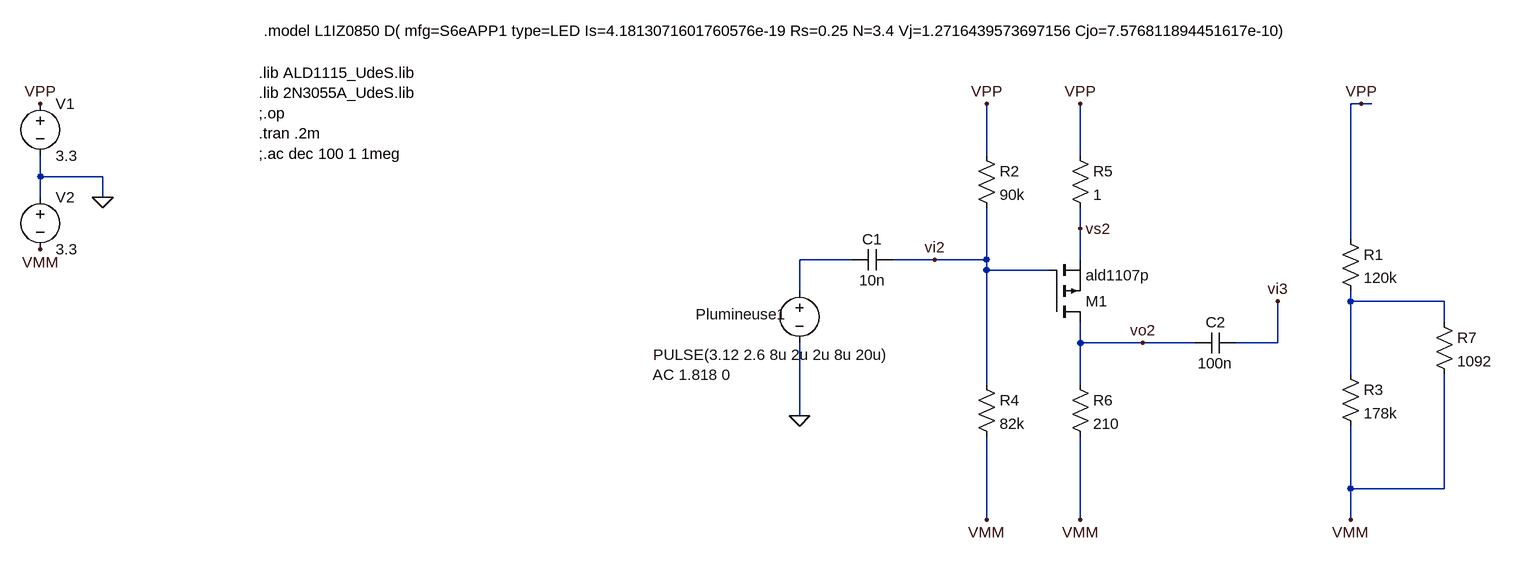
[diagram p0: schematic etage2.asc]
etage2.asc, the LTspice schematic file:
Version 4
SHEET 1 2260 1556
WIRE 1056 -48 1040 -48
WIRE 1072 -48 1056 -48
WIRE 480 32 480 -48
WIRE 624 32 624 -48
WIRE -976 64 -976 32
WIRE -880 64 -976 64
WIRE -976 96 -976 64
WIRE -880 96 -880 64
WIRE 624 144 624 112
WIRE 1040 160 1040 -48
WIRE 272 192 192 192
WIRE 400 192 336 192
WIRE 480 192 480 112
WIRE 480 192 400 192
WIRE 624 192 624 144
WIRE 480 208 480 192
WIRE 576 208 480 208
WIRE 192 240 192 192
WIRE 1040 256 1040 240
WIRE 1184 256 1040 256
WIRE 1184 288 1184 256
WIRE 624 320 624 288
WIRE 720 320 624 320
WIRE 800 320 720 320
WIRE 928 320 928 256
WIRE 928 320 864 320
WIRE 1040 368 1040 256
WIRE 480 384 480 208
WIRE 624 384 624 320
WIRE 192 432 192 320
WIRE 1040 544 1040 448
WIRE 1184 544 1184 368
WIRE 1184 544 1040 544
WIRE 480 592 480 464
WIRE 624 592 624 464
WIRE 1040 592 1040 544
FLAG -976 -48 VPP
FLAG -976 176 VMM
FLAG -880 96 0
FLAG 480 -48 VPP
FLAG 480 592 VMM
FLAG 624 -48 VPP
FLAG 624 592 VMM
FLAG 400 192 vi2
FLAG 720 320 vo2
FLAG 624 144 vs2
FLAG 928 256 vi3
FLAG 192 432 0
FLAG 1056 -48 VPP
FLAG 1040 592 VMM
SYMBOL /voltage -976 -64 R0
WINDOW 123 0 0 Left 0
WINDOW 39 0 0 Left 0
SYMATTR InstName V1
SYMATTR Value 3.3
SYMBOL /voltage -976 80 R0
WINDOW 123 0 0 Left 0
WINDOW 39 0 0 Left 0
SYMATTR InstName V2
SYMATTR Value 3.3
SYMBOL /pmos 576 288 M180
SYMATTR InstName M1
SYMATTR Value ald1107p
SYMATTR Prefix X
SYMBOL /res 464 16 R0
SYMATTR InstName R2
SYMATTR Value 90k
SYMBOL /res 464 368 R0
SYMATTR InstName R4
SYMATTR Value 82k
SYMBOL /res 608 16 R0
SYMATTR InstName R5
SYMATTR Value 1
SYMBOL /res 608 368 R0
SYMATTR InstName R6
SYMATTR Value 210
SYMBOL voltage 192 224 R0
WINDOW 3 -225 114 Left 2
WINDOW 123 -226 145 Left 2
WINDOW 39 0 0 Left 0
WINDOW 0 -160 52 Left 2
SYMATTR Value PULSE(3.12 2.6 8u 2u 2u 8u 20u)
SYMATTR Value2 AC 1.818 0
SYMATTR InstName Plumineuse1
SYMBOL cap 336 176 R90
WINDOW 0 0 32 VBottom 2
WINDOW 3 32 32 VTop 2
SYMATTR InstName C1
SYMATTR Value 10n
SYMBOL res 1024 144 R0
SYMATTR InstName R1
SYMATTR Value 120k
SYMBOL res 1024 352 R0
SYMATTR InstName R3
SYMATTR Value 178k
SYMBOL cap 864 304 R90
WINDOW 0 0 32 VBottom 2
WINDOW 3 32 32 VTop 2
SYMATTR InstName C2
SYMATTR Value 100n
SYMBOL res 1168 272 R0
SYMATTR InstName R7
SYMATTR Value 1092
TEXT -640 -96 Left 2 !.lib ALD1115_UdeS.lib\n.lib 2N3055A_UdeS.lib\n;.op\n.tran .2m\n;.ac dec 100 1 1meg
TEXT -632 -160 Left 2 !.model L1IZ0850 D( mfg=S6eAPP1 type=LED Is=4.1813071601760576e-19 Rs=0.25 N=3.4 Vj=1.2716439573697156 Cjo=7.576811894451617e-10)

The netlist it stands for:
* etage2.asc
V1 VPP 0 3.3
V2 0 VMM 3.3
XM1 vo2 vi2 vs2 ald1107p  ; pins D G S
R2 VPP vi2 90k
R4 vi2 VMM 82k
R5 VPP vs2 1
R6 vo2 VMM 210
V§Plumineuse1 N001 0 PULSE(3.12 2.6 8u 2u 2u 8u 20u) AC 1.818 0
C1 vi2 N001 10n
R1 VPP N002 120k
R3 N002 VMM 178k
C2 vi3 vo2 100n
R7 N002 VMM 1092
.lib ALD1115_UdeS.lib
.lib 2N3055A_UdeS.lib
;.op
.tran .2m
;.ac dec 100 1 1meg
.model L1IZ0850 D( mfg=S6eAPP1 type=LED Is=4.1813071601760576e-19 Rs=0.25 N=3.4 Vj=1.2716439573697156 Cjo=7.576811894451617e-10)
.backanno
.end